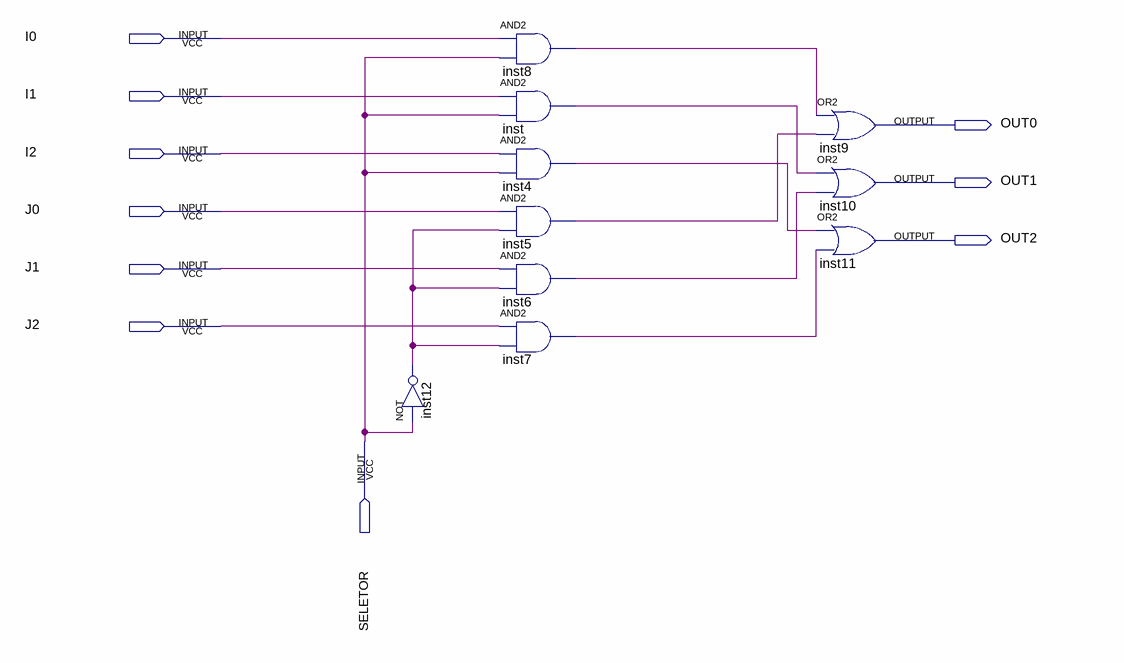
[diagram p0: schematic sheet]
// Quartus schematic MUX3BITS.bdf as structural Verilog: 10 symbols, 10 pins
module MUX3BITS (
  input  I0,
  input  I1,
  input  I2,
  input  J0,
  input  J1,
  input  J2,
  input  SELETOR,
  output OUT0,
  output OUT1,
  output OUT2
);

  wire inst4_out, inst5_out, inst6_out, inst7_out, inst8_out, inst12_out, inst_out;

  not inst12 (inst12_out, SELETOR);
  and inst8 (inst8_out, I0, SELETOR);
  and inst (inst_out, I1, SELETOR);
  and inst4 (inst4_out, I2, SELETOR);
  and inst5 (inst5_out, J0, inst12_out);
  and inst6 (inst6_out, J1, inst12_out);
  and inst7 (inst7_out, J2, inst12_out);
  or inst9 (OUT0, inst8_out, inst5_out);
  or inst10 (OUT1, inst_out, inst6_out);
  or inst11 (OUT2, inst4_out, inst7_out);
endmodule
